# EAGLE design Tayloe Detector v5 (EAGLE 9.1.2)
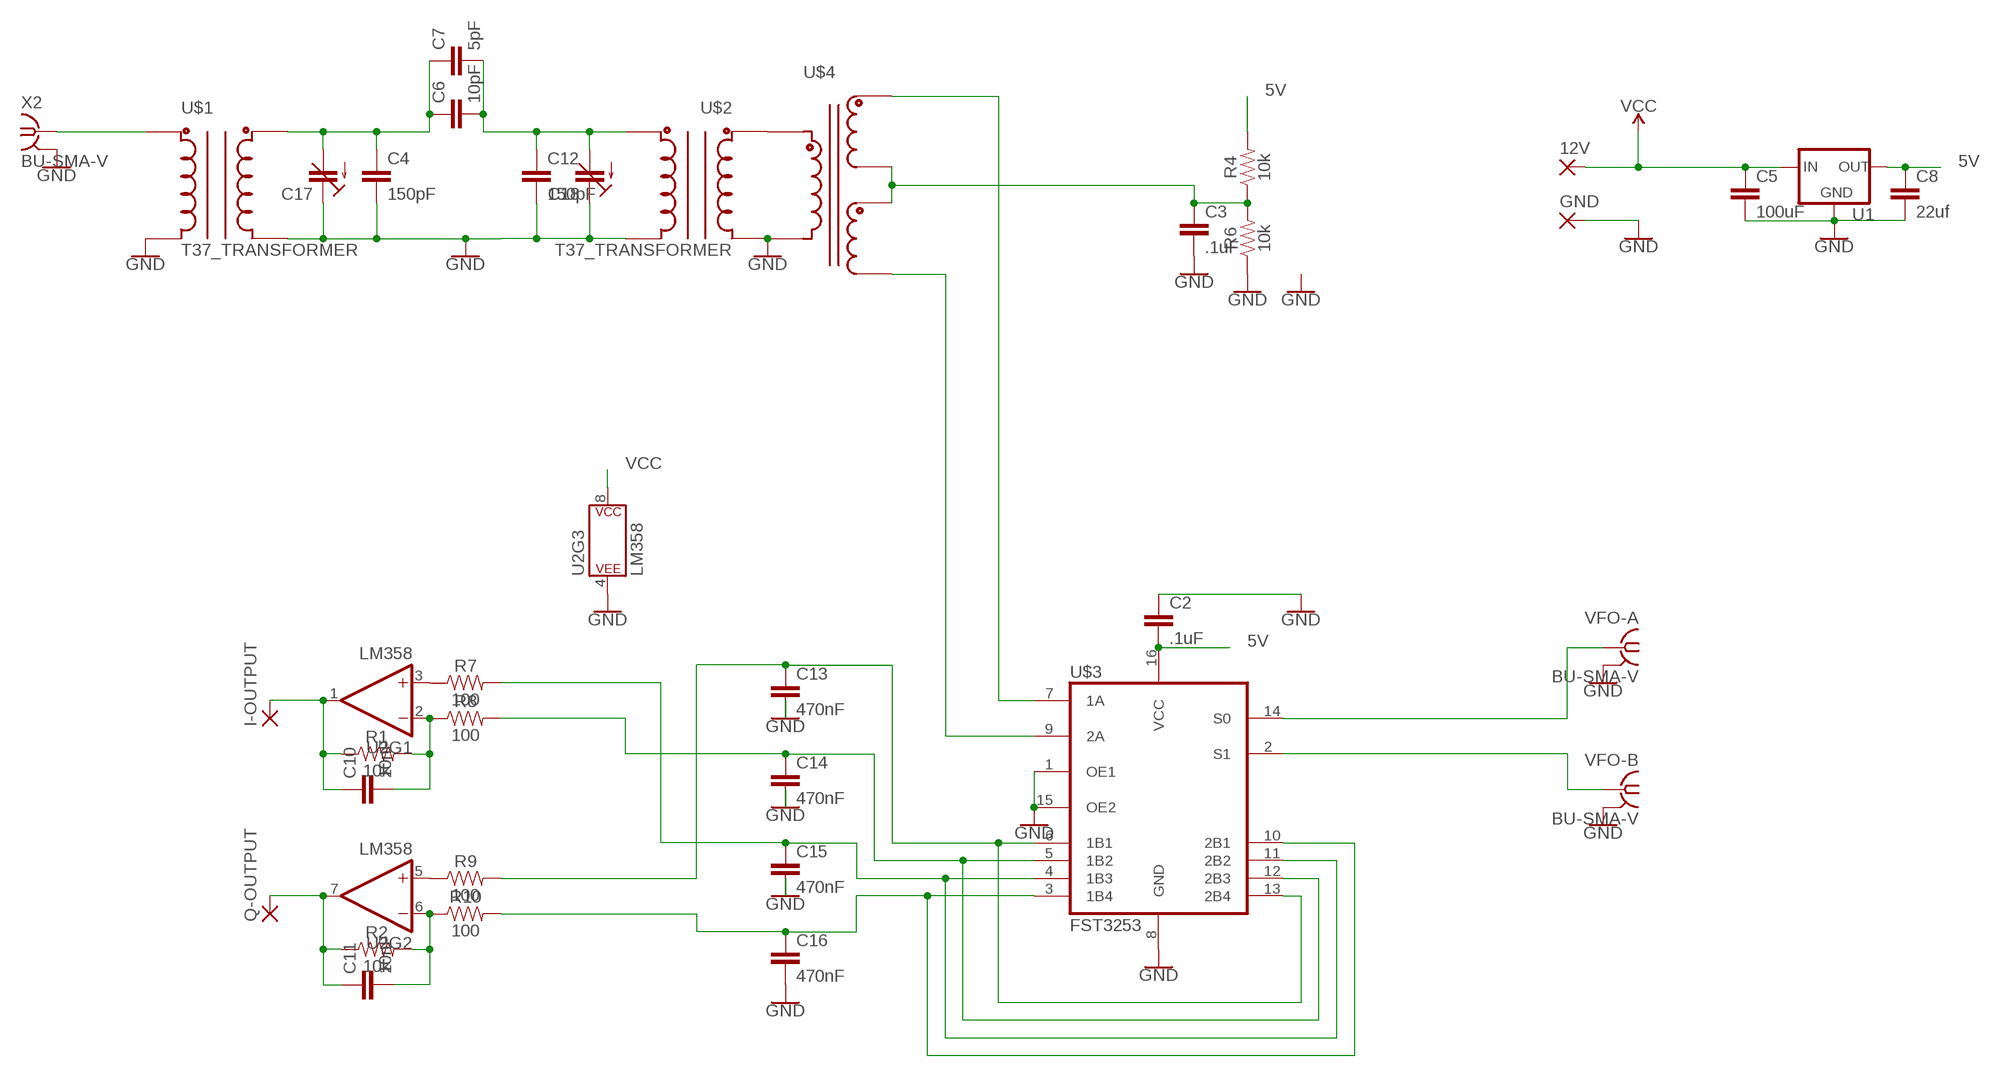
[diagram p0: schematic, sheet 1]

## Parts
12V  3,17/1,1  [3,17/1,1]
C2  .1uF  C5/3.5  [C5B3.5]
C3  .1uF  C5/3.5  [C5B3.5]
C4  150pF  C5/3.5  [C5B3.5]
C5  100uF  C5/3.5  [C5B3.5]
C6  10pF  C5/3.5  [C5B3.5]
C7  5pF  C5/3.5  [C5B3.5]
C8  22uf  C5/3.5  [C5B3.5]
C10  10nF  C5/3.5  [C5B3.5]
C11  10nF  C5/3.5  [C5B3.5]
C12  150pF  C5/3.5  [C5B3.5]
C13  470nF  C5/3.5  [C5B3.5]
C14  470nF  C5/3.5  [C5B3.5]
C15  470nF  C5/3.5  [C5B3.5]
C16  470nF  C5/3.5  [C5B3.5]
C17  C-TRIMMTZ03  [CTRIMTZ03]
C18  C-TRIMMTZ03  [CTRIMTZ03]
GND  3,17/1,1  [3,17/1,1]
I-OUTPUT  3,17/1,1  [3,17/1,1]
Q-OUTPUT  3,17/1,1  [3,17/1,1]
R1  10k  1KOHM-HORIZ-1/4W-1%  [AXIAL-0.3]
R2  10k  1KOHM-HORIZ-1/4W-1%  [AXIAL-0.3]
R4  10k  1KOHM-HORIZ-1/4W-1%  [AXIAL-0.3]
R6  10k  1KOHM-HORIZ-1/4W-1%  [AXIAL-0.3]
R7  100  1KOHM-HORIZ-1/4W-1%  [AXIAL-0.3]
R8  100  1KOHM-HORIZ-1/4W-1%  [AXIAL-0.3]
R9  100  1KOHM-HORIZ-1/4W-1%  [AXIAL-0.3]
R10  100  1KOHM-HORIZ-1/4W-1%  [AXIAL-0.3]
U1  V_REG_78XXTO-92_UNTESTED  [TO-92]
U2  LM358  [DIP08]
U$1  T37_TRANSFORMER  [T37_TRANSFORMER]
U$2  T37_TRANSFORMER  [T37_TRANSFORMER]
U$3  FST3253  [SO16]
U$4  T50_SPLITTER  [T50_SPLITTER]
VFO-A  BU-SMA-V  [BU-SMA-V]
VFO-B  BU-SMA-V  [BU-SMA-V]
X2  BU-SMA-V  [BU-SMA-V]

## Nets
5V: C2.2 C8.1 R4.P$2 U1.1(OUT) U$3.16(VCC)
GND: C2.1 C3.2 C4.2 C5.2 C8.2 C12.2 C13.2 C14.2 C15.2 C16.2 C17.1(E) C18.1(E) GND.1(P) R6.P$1 U1.2(GND) U2.4(P$V-) U$1.C1A U$1.C2A U$2.C1A U$2.C2A U$3.1(OE1) U$3.8(GND) U$3.15(OE2) U$4.C1A VFO-A.2 VFO-A.3 VFO-A.4 VFO-A.5 VFO-B.2 VFO-B.3 VFO-B.4 VFO-B.5 X2.2 X2.3 X2.4 X2.5
N$1: C13.1 R9.P$2 U$3.6(1B1) U$3.13(2B4)
N$2: R7.P$1 U2.3(+IN)
N$3: C16.1 R10.P$2 U$3.3(1B4) U$3.10(2B1)
N$4: C4.1 C6.1 C7.1 C17.2(A) U$1.C2B
N$5: C15.1 R7.P$2 U$3.4(1B3) U$3.11(2B2)
N$6: C10.2 R1.P$2 R8.P$1 U2.2(-IN)
N$7: C6.2 C7.2 C12.1 C18.2(A) U$2.C2B
N$8: R9.P$1 U2.5(+IN)
N$9: U$1.C1B X2.1
N$10: C10.1 I-OUTPUT.1(P) R1.P$1 U2.1(OUT)
N$12: C11.2 R2.P$2 R10.P$1 U2.6(-IN)
N$15: U$3.14(S0) VFO-A.1
N$16: C11.1 Q-OUTPUT.1(P) R2.P$1 U2.7(OUT)
N$17: U$3.2(S1) VFO-B.1
N$19: U$3.7(1A) U$4.C3B(C2B)
N$20: C3.1 R4.P$1 R6.P$2 U$4.C2A(C3B) U$4.C3A(C2A)
N$21: U$2.C1B U$4.C1B
N$22: C14.1 R8.P$2 U$3.5(1B2) U$3.12(2B3)
N$23: U$3.9(2A) U$4.C2B(C3A)
VCC: 12V.1(P) C5.1 U1.3(IN) U2.8(P$V+)

## Library data of the parts
12V GND I-OUTPUT Q-OUTPUT = wirepad:3,17/1,1: THROUGH-HOLE PAD
C2-C8 C10-C16 = capacitor-wima:C: CAPACITOR naming: grid - package width
C17 C18 = resistor:C-TRIMM: Trimm capacitor
R1 R2 R4 R6-R10 = SparkFun-Resistors:1KOHM: 1kΩ resistor A resistor is a passive two-terminal electrical component that implements electrical resistance as a circuit element. Resistors act to reduce current flow, and, at the same time, act to lower voltage levels within circuits. - Wikipedia; PROD_ID: RES-12182; VALUE: 1k
U1 = SparkFun-IC-Power:V_REG_78XX: Voltage Regulator Standard 78xx regulator. IGO (Input Ground Output). Spark Fun Electronics SKU : COM-00107
U2 = SparkFun-IC-Amplifiers:LM358: LM358 Jellybean op-amp Datasheet <http://www.sparkfun.com/datasheets/Components/General/LM358.pdf> SparkFun Products Op-Amp (Thru-Hole) - LM358 <https://www.sparkfun.com/products/9456> (COM-09456); PROD_ID: IC-09172
U$1 U$2 = toroid:T37_TRANSFORMER: Transformer wound on a T37 Toroid
U$3 = SparkFun-IC-Comms:FST3253: The Fairchild Switch FST3253 is a dual 4:1 high-speed CMOS TTL-compatible multiplexer/demultiplexer bus switch. The low on resistance of the switch allows inputs to be connected to outputs without adding propagation delay or generating additional ground bounce noise. When OE is LOW, S0 and S1 connect the A Port to the selected B Port output. When OE is HIGH, the switch is OPEN and a high-impedance state exists between the two
U$4 = toroid:T50_SPLITTER: Transformer (having 3 windings) on a T50 Toroid
VFO-A VFO-B X2 = con-coax:BU-SMA-V: FEMALE SMA CONNECTOR Radiall distributor RS 112-3794; OC_FARNELL: unknown; OC_NEWARK: unknown

## Net classes
0 default: width 0.762 mm, drill 0.762 mm, clearance 0.508 mm

## Board
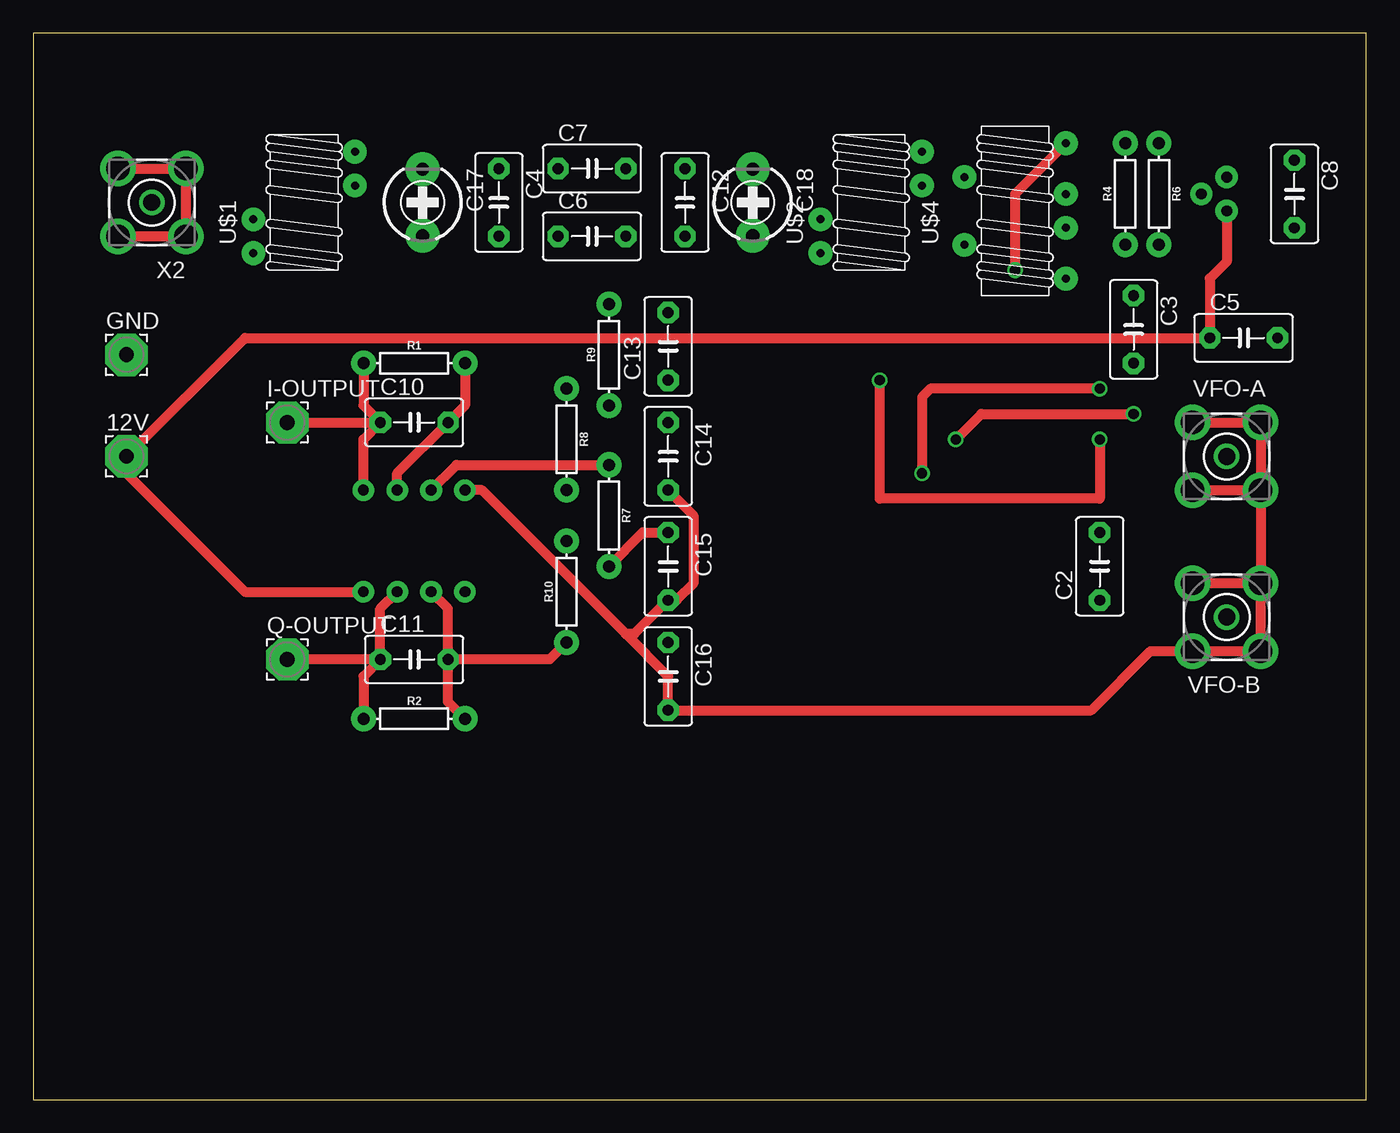
[diagram p1: board, top side]
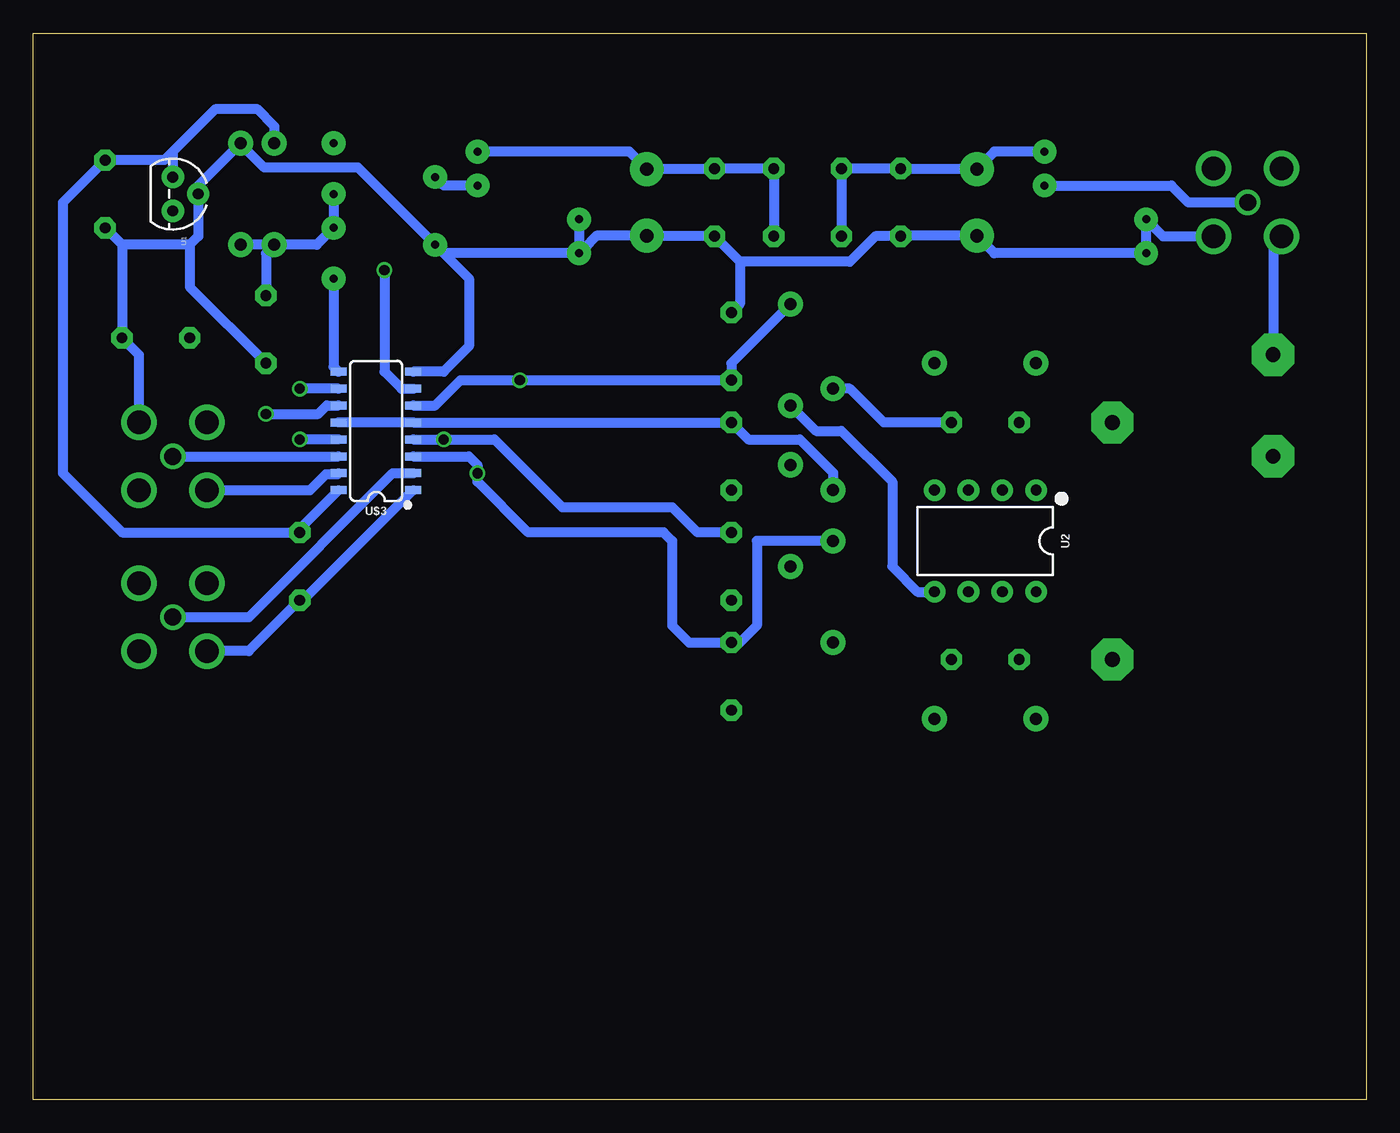
[diagram p2: board, bottom side, seen from below]

Size 100 x 80 mm. Coordinates in mm from the lower left corner, seen from the top.
Outline: 0,0 100,0 100,80 0,80 0,0
Copper layers (1*16): Top 0.035mm / dielectric 1.5mm / Bottom 0.035mm
Design rules "default": minimum track width 6mil, minimum drill 0.35mm, track to track 6mil, track to pad 6mil, pad to pad 6mil, via to via 6mil, smd to smd 6mil, copper to edge 40mil, drill to drill 6mil, minimum pad ring 10mil, minimum via ring 8mil, stop-mask expansion 4mil, vias tented up to drill 0mil, thermal gap 10mil

### Footprints (pad centres in the part's own frame; a part is rotated, then mirrored left to right if it is on the bottom)
3,17/1,1 = drill 1.118 pad 3.175 octagon: 1 0,0
C5B3.5 = drill 0.813 pad 1.6 octagon: 1 -2.54,0; 2 2.54,0
CTRIMTZ03 = drill 1 pad 2.54: 1 0,2.5; 2 0,-2.5
AXIAL-0.3 = drill 0.9 pad 1.88: P$1 -3.81,0; P$2 3.81,0
TO-92 = drill 0.813 pad 1.676: 1 -1.27,0; 2 0,1.905; 3 1.27,0
DIP08 = drill 0.813 pad 1.626: 1 -3.81,-3.81; 2 -1.27,-3.81; 3 1.27,-3.81; 4 3.81,-3.81; 5 3.81,3.81; 6 1.27,3.81; 7 -1.27,3.81; 8 -3.81,3.81
T37_TRANSFORMER = drill 0.6 pad 1.778: C1A -3.81,-3.81; C1B 3.81,1.27; C2A -3.81,-1.27; C2B 3.81,3.81
SO16 = smd 0.6 x 1.2: 1 -4.445,-2.8; 2 -3.175,-2.8; 3 -1.905,-2.8; 4 -0.635,-2.8; 5 0.635,-2.8; 6 1.905,-2.8; 7 3.175,-2.8; 8 4.445,-2.8; 9 4.445,2.8; 10 3.175,2.8; 11 1.905,2.8; 12 0.635,2.8; 13 -0.635,2.8; 14 -1.905,2.8; 15 -3.175,2.8; 16 -4.445,2.8
T50_SPLITTER = drill 0.6 pad 1.778: C1A -1.27,-5.08; C1B -1.27,0; C2A 6.35,-3.81; C2B 6.35,-7.62; C3A 6.35,-1.27; C3B 6.35,2.54
BU-SMA-V = drill 1.27: 1 0,0 | drill 1.778: 2 -2.55,2.55; 3 2.55,2.55; 4 2.55,-2.55; 5 -2.55,-2.55

### Placement (x,y rotation side)
12V  6.99,48.26 0 top
C2  80.01,40.01 90 top
C3  82.55,57.78 270 top
C4  34.92,67.31 270 top
C5  90.81,57.15 0 top
C6  41.91,64.77 0 top
C7  41.91,69.85 0 top
C8  94.61,67.94 270 top
C10  28.57,50.8 0 top
C11  28.57,33.02 0 top
C12  48.9,67.31 270 top
C13  47.62,56.52 90 top
C14  47.62,48.26 270 top
C15  47.62,40.01 270 top
C16  47.62,31.75 270 top
C17  29.21,67.31 180 top
C18  53.98,67.31 180 top
GND  6.99,55.88 0 top
I-OUTPUT  19.05,50.8 0 top
Q-OUTPUT  19.05,33.02 0 top
R1  28.57,55.24 0 top
R2  28.57,28.57 0 top
R4  81.92,67.94 90 top
R6  84.45,67.94 270 top
R7  43.18,43.81 270 top
R8  40.01,49.53 270 top
R9  43.18,55.88 90 top
R10  40.01,38.1 90 top
U1  89.53,67.94 270 bottom
U2  28.57,41.91 180 bottom
U$1  20.32,67.31 0 top
U$2  62.87,67.31 0 top
U$3  74.3,50.16 90 bottom
U$4  71.12,69.22 0 top
VFO-A  89.53,48.26 0 top
VFO-B  89.53,36.2 180 top
X2  8.89,67.31 180 top

### Tracks (layer width: path | path; a pad name or v marks a point on that pad's centre or on a via)
5V
  Bottom 0.762: R4.P$2 81.92,73.03 83.19,74.3 86.36,74.3 89.53,71.12 | 89.53,71.12 U1.1 | 89.53,71.12 90.17,70.48 C8.1 97.79,67.31 97.79,46.99 93.34,42.55 C2.2 80.01,42.8 U$3.16
GND
  Top 0.762: C14.2 49.53,43.81 49.53,38.73 48.26,37.47 C15.2 45.09,34.92 44.45,34.92 | U2.4 33.66,45.72 44.45,34.92 | 44.45,34.92 47.62,31.75 C16.2 79.38,29.21 83.82,33.66 83.83,33.65 VFO-B.3 VFO-B.2 VFO-B.5 | VFO-A.4 VFO-B.5 | VFO-B.4 VFO-B.5 | VFO-A.2 VFO-A.3 VFO-A.4 | VFO-A.4 VFO-A.5 | X2.4 X2.5 X2.2 X2.3
  Bottom 0.762: X2.2 15.23,64.76 U$1.C2A U$1.C1A 27.9,63.5 C17.1 34.88,64.81 C4.2 36.83,64.77 38.73,62.87 46.99,62.87 | 46.99,62.87 C12.2 53.94,64.77 C18.1 57.74,64.81 58.74,63.82 | 58.74,63.82 U$2.C1A 69.22,63.5 U$4.C1A | U$2.C2A 59.05,64.14 58.74,63.82 | 88.27,64.14 87.63,64.77 U1.2 87.63,68.58 84.77,71.44 | 93.34,64.14 C8.2 | 88.27,64.14 93.34,64.14 | 93.34,64.14 C5.2 92.08,55.89 VFO-A.3 | R6.P$1 84.77,71.44 | 6.99,64.11 X2.3 6.99,64.11 | 84.77,71.44 84.18,71.44 82.67,69.93 75.64,69.93 U$4.C1A | 88.27,64.14 88.27,60.96 C3.2 | U$4.C1A 67.31,61.59 67.31,56.52 69.22,54.61 U$3.8 | U$3.15 77.18,46.91 78.06,46.91 79.26,45.71 VFO-A.5 | VFO-B.3 83.83,33.65 C2.1 79.75,37.47 U$3.1 | 46.99,62.87 46.99,59.69 C13.2 | 6.99,64.11 GND.1
N$1  (via drill 0.76)
  Top 0.762: v80.01,49.53 80.01,45.09 63.5,45.09 v63.5,53.98
  Bottom 0.762: R9.P$2 47.62,55.24 C13.1 v63.5,53.98 67.94,53.98 69.85,52.07 U$3.6 | U$3.13 v80.01,49.53
N$2
  Top 0.762: U2.3 31.75,47.62 R7.P$1
N$3  (via drill 0.76)
  Top 0.762: v80.01,53.34 67.31,53.34 66.67,52.7 v66.67,46.99
  Bottom 0.762: R10.P$2 45.72,41.91 45.72,35.56 46.99,34.29 C16.1 50.8,34.29 52.07,35.56 52.07,41.91 52.7,42.55 62.87,42.55 66.67,46.35 v66.67,46.99 66.67,47.62 67.31,48.26 U$3.3 | U$3.10 v80.01,53.34
N$4
  Bottom 0.762: U$1.C2B 27.9,71.12 C17.2 34.88,69.81 C4.1 C7.1 C6.1
N$5  (via drill 0.76)
  Top 0.762: R7.P$2 45.72,42.55 C15.1 | v69.22,49.53 71.12,51.44 v82.55,51.44
  Bottom 0.762: C15.1 50.16,42.55 52.07,44.45 60.33,44.45 65.41,49.53 v69.22,49.53 U$3.4 | v82.55,51.44 78.62,51.44 77.98,52.07 U$3.11
N$6
  Top 0.762: U2.2 27.3,46.99 C10.2 32.38,52.07 R1.P$2
  Bottom 0.762: C10.2 36.2,50.8 38.73,53.34 R8.P$1
N$7
  Bottom 0.762: C6.2 C7.2 C12.1 48.94,69.81 C18.2 55.28,71.12 U$2.C2B
N$8
  Bottom 0.762: R9.P$1 41.27,50.16 39.37,50.16 35.56,46.35 35.56,40.01 33.66,38.1 U2.5
N$9
  Bottom 0.762: X2.1 13.34,67.31 14.61,68.58 U$1.C1B
N$10
  Top 0.762: U2.1 24.77,49.53 C10.1 | R1.P$1 24.77,52.07 C10.1 | I-OUTPUT.1 C10.1
N$12
  Top 0.762: C11.2 31.11,36.83 U2.6 | R2.P$2 31.11,29.84 C11.2 | R10.P$1 38.73,33.02 C11.2
N$15
  Bottom 0.762: VFO-A.1 U$3.14
N$16
  Top 0.762: C11.1 26.04,36.83 U2.7 | C11.1 Q-OUTPUT.1 | C11.1 24.77,31.75 R2.P$1
N$17
  Bottom 0.762: U$3.2 73.03,46.99 83.82,36.2 VFO-B.1
N$19  (via drill 0.76)
  Top 0.762: U$4.C3B 73.66,67.94 v73.66,62.23
  Bottom 0.762: U$3.7 72.38,53.34 73.66,54.62 v73.66,62.23
N$20
  Bottom 0.762: R4.P$1 78.74,64.14 U$4.C2A U$4.C3A | R4.P$1 R6.P$2 | R4.P$1 82.55,63.5 C3.1
N$21
  Bottom 0.762: U$2.C1B 69.22,68.58 U$4.C1B
N$22
  Bottom 0.762: R8.P$2 40.01,47.04 42.5,49.53 46.35,49.53 C14.1 U$3.5 U$3.12
N$23
  Bottom 0.762: U$4.C2B 77.47,54.98 U$3.9
VCC
  Top 0.762: U1.3 89.53,62.87 88.27,61.59 C5.1 15.88,57.15 12V.1 6.99,46.99 15.88,38.1 U2.8